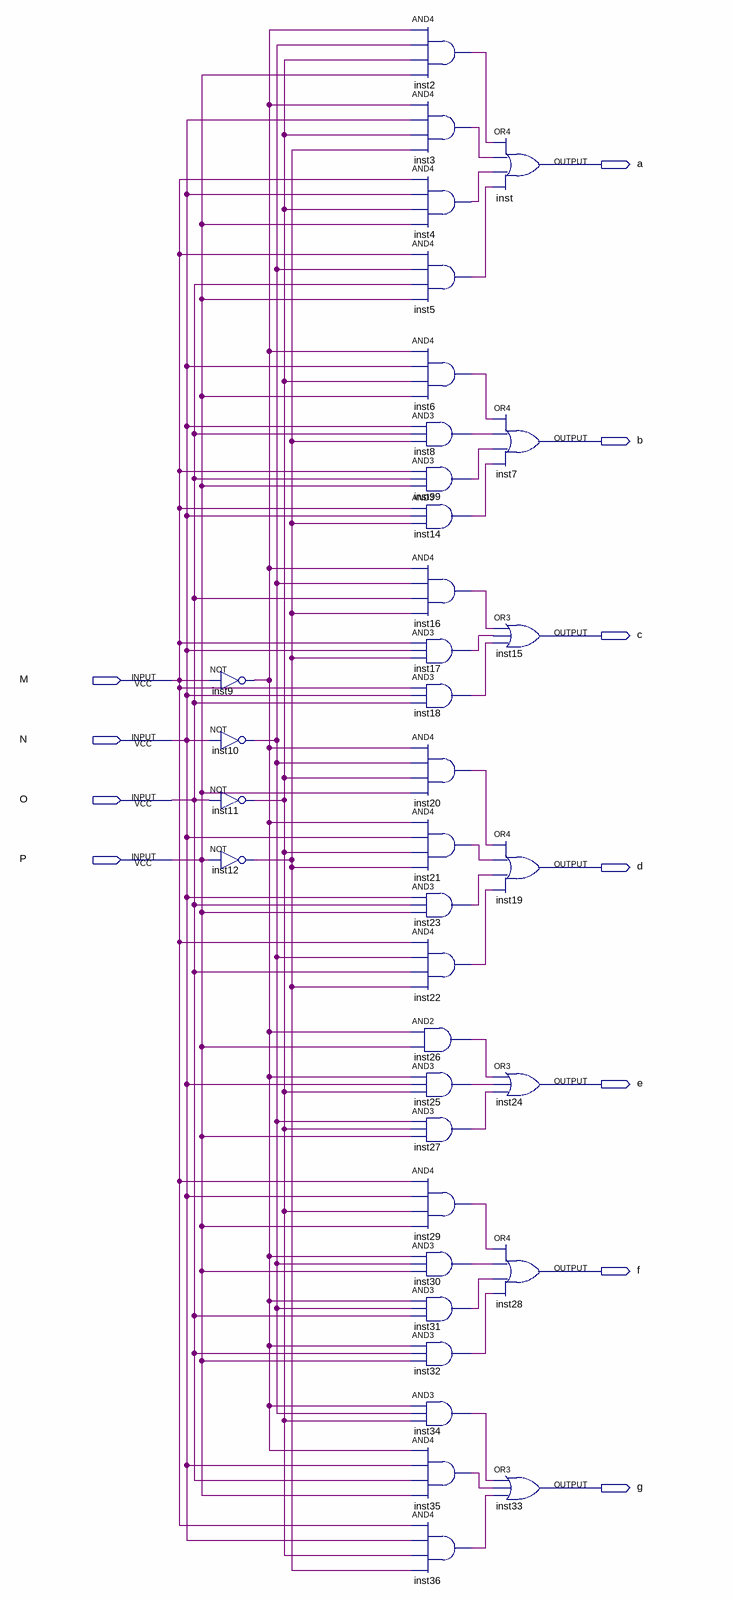
[diagram p0: schematic sheet]
// Quartus schematic seg.bdf as structural Verilog: 36 symbols, 11 pins
module seg (
  input  M,
  input  N,
  input  O,
  input  P,
  output a,
  output b,
  output c,
  output d,
  output e,
  output f,
  output g
);

  wire inst2_out, inst3_out, inst4_out, inst5_out, inst6_out, inst8_out, inst9_out, inst10_out, inst11_out,
       inst12_out, inst14_out, inst16_out, inst17_out, inst18_out, inst20_out, inst21_out, inst22_out,
       inst23_out, inst25_out, inst26_out, inst27_out, inst29_out, inst30_out, inst31_out, inst32_out,
       inst34_out, inst35_out, inst36_out, inst99_out;

  not inst9 (inst9_out, M);
  not inst10 (inst10_out, N);
  not inst11 (inst11_out, O);
  not inst12 (inst12_out, P);
  and inst2 (inst2_out, inst9_out, inst10_out, inst11_out, P);
  and inst3 (inst3_out, inst9_out, N, inst11_out, inst12_out);
  and inst4 (inst4_out, M, N, inst11_out, P);
  and inst5 (inst5_out, M, inst10_out, O, P);
  and inst6 (inst6_out, inst9_out, N, inst11_out, P);
  and inst8 (inst8_out, N, O, inst12_out);
  and inst99 (inst99_out, M, O, P);
  and inst14 (inst14_out, M, N, inst12_out);
  and inst16 (inst16_out, inst9_out, inst10_out, O, inst12_out);
  and inst17 (inst17_out, M, N, inst12_out);
  and inst18 (inst18_out, M, N, O);
  and inst20 (inst20_out, inst9_out, inst10_out, inst11_out, P);
  and inst21 (inst21_out, inst9_out, N, inst11_out, inst12_out);
  and inst23 (inst23_out, N, O, P);
  and inst22 (inst22_out, M, inst10_out, O, inst12_out);
  and inst26 (inst26_out, inst9_out, P);
  and inst25 (inst25_out, inst9_out, N, inst11_out);
  and inst27 (inst27_out, inst10_out, inst11_out, P);
  and inst29 (inst29_out, M, N, inst11_out, P);
  and inst30 (inst30_out, inst9_out, inst10_out, P);
  and inst31 (inst31_out, inst9_out, inst10_out, O);
  and inst32 (inst32_out, inst9_out, O, P);
  and inst34 (inst34_out, inst9_out, inst10_out, inst11_out);
  and inst35 (inst35_out, inst9_out, N, O, P);
  and inst36 (inst36_out, M, N, inst11_out, inst12_out);
  or inst (a, inst2_out, inst3_out, inst4_out, inst5_out);
  or inst7 (b, inst6_out, inst8_out, inst99_out, inst14_out);
  or inst15 (c, inst16_out, inst17_out, inst18_out);
  or inst19 (d, inst20_out, inst21_out, inst23_out, inst22_out);
  or inst24 (e, inst26_out, inst25_out, inst27_out);
  or inst28 (f, inst29_out, inst30_out, inst31_out, inst32_out);
  or inst33 (g, inst34_out, inst35_out, inst36_out);
endmodule
